# Altium schematic sheet switch_control.SchDoc
size 297 x 209 mm
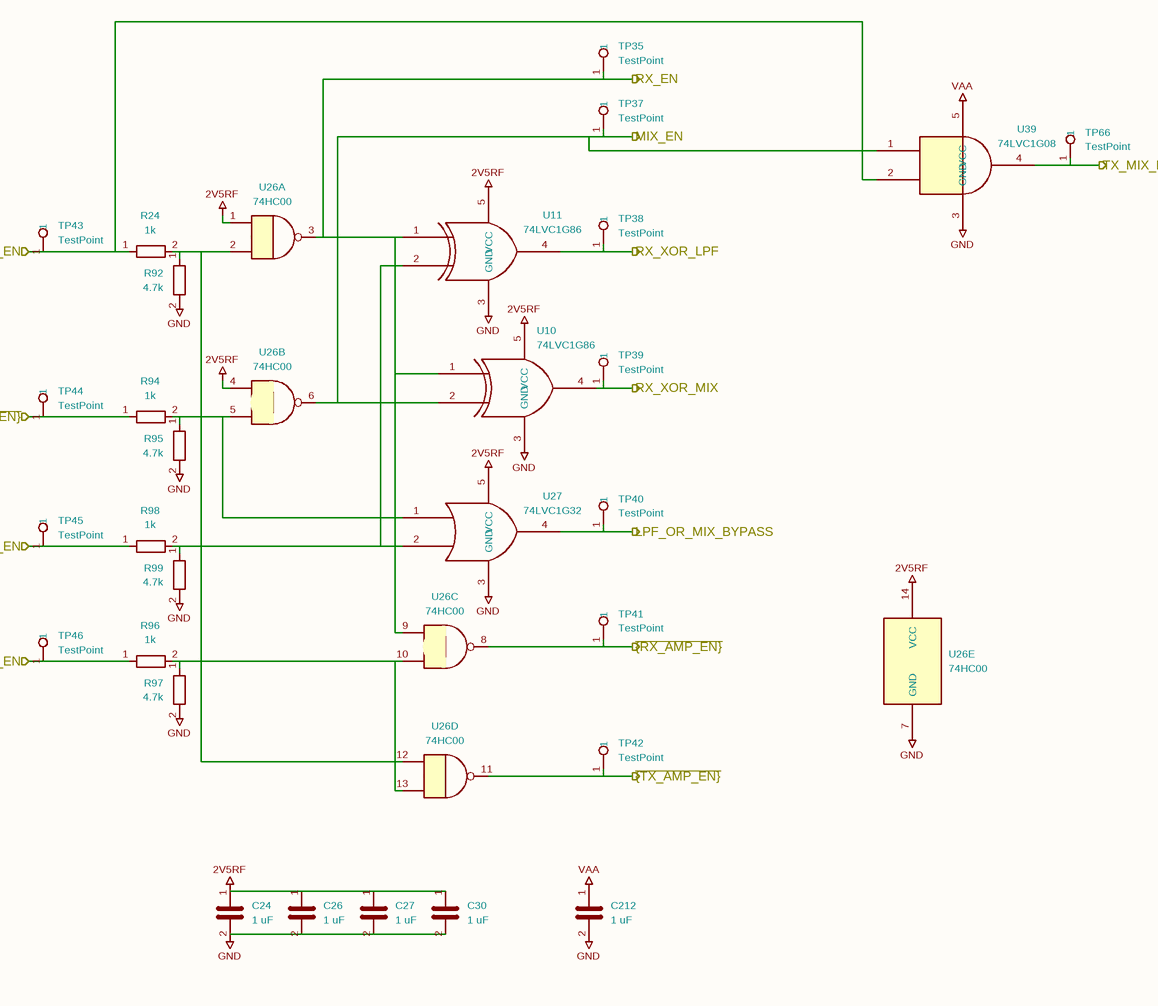
[diagram p0: switch_control.SchDoc]

## Parts
C24  1 uF  [C_0201_0603Metric]
C26  1 uF  [C_0201_0603Metric]
C27  1 uF  [C_0201_0603Metric]
C30  1 uF  [C_0201_0603Metric]
C212  1 uF  [C_0201_0603Metric]
R24  1k  [R_0201_0603Metric]
R92  4.7k  [R_0201_0603Metric]
R94  1k  [R_0201_0603Metric]
R95  4.7k  [R_0201_0603Metric]
R96  1k  [R_0201_0603Metric]
R97  4.7k  [R_0201_0603Metric]
R98  1k  [R_0201_0603Metric]
R99  4.7k  [R_0201_0603Metric]
TP35  TestPoint  [TestPoint_Pad_D1.0mm]
TP37  TestPoint  [TestPoint_Pad_D1.0mm]
TP38  TestPoint  [TestPoint_Pad_D1.0mm]
TP39  TestPoint  [TestPoint_Pad_D1.0mm]
TP40  TestPoint  [TestPoint_Pad_D1.0mm]
TP41  TestPoint  [TestPoint_Pad_D1.0mm]
TP42  TestPoint  [TestPoint_Pad_D1.0mm]
TP43  TestPoint  [TestPoint_Pad_D1.0mm]
TP44  TestPoint  [TestPoint_Pad_D1.0mm]
TP45  TestPoint  [TestPoint_Pad_D1.0mm]
TP46  TestPoint  [TestPoint_Pad_D1.0mm]
TP66  TestPoint  [TestPoint_Pad_D1.0mm]
U10  74LVC1G86  [SOT-353_SC-70-5]
U11  74LVC1G86  [SOT-353_SC-70-5]
U26  74HC00  [DHVQFN-14-1EP_2.5x3mm_P0.5mm_EP1x1.5mm]  (parts A,B,C,D,E of 5)
U27  74LVC1G32  [SOT-353_SC-70-5]
U39  74LVC1G08  [SOT-353_SC-70-5]

## Ports
LPF_EN (in), LPF_OR_MIX_BYPASS (out), MIX_EN (out), RF_AMP_EN (in), RX_EN (out), RX_XOR_LPF (out), RX_XOR_MIX (out), TX_EN (in), TX_MIX_EN (out), ~{{MIX_EN}} (in), ~{{RX_AMP_EN}} (out), ~{{TX_AMP_EN}} (out)

## Nets
2V5RF: C24.1 C26.1 C27.1 C30.1 U10.5(VCC) U11.5(VCC) U26.1 U26.4 U26.14(VCC) U27.5(VCC)
GND: C24.2 C26.2 C27.2 C30.2 C212.2 R92.2 R95.2 R97.2 R99.2 U10.3(GND) U11.3(GND) U26.7(GND) U27.3(GND) U39.3(GND)
VAA: C212.1 U39.5(VCC)
LPF_EN: R98.1 TP45.1 ; port LPF_EN
LPF_OR_MIX_BYPASS: TP40.1 U27.4 ; port LPF_OR_MIX_BYPASS
MIX_EN: TP37.1 U10.2 U26.6 U39.1 ; port MIX_EN
RF_AMP_EN: R96.1 TP46.1 ; port RF_AMP_EN
RX_EN: TP35.1 U10.1 U11.1 U26.3 U26.9 ; port RX_EN
RX_XOR_LPF: TP38.1 U11.4 ; port RX_XOR_LPF
RX_XOR_MIX: TP39.1 U10.4 ; port RX_XOR_MIX
TX_EN: R24.1 TP43.1 U39.2 ; port TX_EN
TX_MIX_EN: TP66.1 U39.4 ; port TX_MIX_EN
~{{MIX_EN}}: R94.1 TP44.1 ; port ~{{MIX_EN}}
~{{RX_AMP_EN}}: TP41.1 U26.8 ; port ~{{RX_AMP_EN}}
~{{TX_AMP_EN}}: TP42.1 U26.11 ; port ~{{TX_AMP_EN}}
NetR24_2: R24.2 R92.1 U26.2 U26.12
NetR94_2: R94.2 R95.1 U26.5 U27.1
NetR96_2: R96.2 R97.1 U26.10 U26.13
NetR98_2: R98.2 R99.1 U11.2 U27.2

## Notes on the sheet
- 1
- 2
- 3
- 4
- 5
- 6
- A
- B
- C
- ${LICENSE}
- D
- Title: ${TITLE}
- File: switch_control.kicad_sch
- Sheet: /
- ${COPYRIGHT}
- KiCad E.D.A.  kicad (5.1.4)-1
- Size: A4
- Date: ${DATE}
- Rev: ${VERSION}
- Id: 1/1

## Library data of the parts
C24 C26 C27 C30 C212 = C: Manufacturer: Murata; Part Number: GRM033R61A105ME44D; Description: CAP CER 1UF 10V X5R 0201; Substitution: GRM033R61A105ME44*, GRM033R61C105ME15*, Samsung CL03A105MO3NRN*; Value: 1 uF; Footprint: Capacitor_SMD:C_0201_0603Metric
R24 R94 R96 R98 = R: Manufacturer: Yageo; Part Number: RC0201FR-071KL; Description: RES 1K OHM 1% 1/20W 0201; Substitution: any equivalent; Value: 1k; Footprint: Resistor_SMD:R_0201_0603Metric
R92 R95 R97 R99 = R: Manufacturer: Yageo; Part Number: RC0201FR-074K7L; Description: RES 4.7K OHM 1% 1/20W 0201; Substitution: any equivalent; Value: 4.7k; Footprint: Resistor_SMD:R_0201_0603Metric
U10 U11 = 74LVC1G86: Manufacturer: UMW; Part Number: SN74LVC1G86DCKR; Description: IC GATE XOR 1CH 2-INP SC70-5; Substitution: TI SN74LVC1G86DCKR; Value: 74LVC1G86; Footprint: Package_TO_SOT_SMD:SOT-353_SC-70-5
U26 = 74HC00: Manufacturer: Nexperia; Part Number: 74HC00BQ,115; Description: IC GATE NAND 4CH 2-INP 14DHVQFN; Value: 74HC00; Footprint: Package_DFN_QFN:DHVQFN-14-1EP_2.5x3mm_P0.5mm_EP1x1.5mm
U27 = 74LVC1G32: Manufacturer: UMW; Part Number: SN74LVC1G32DCKR; Description: IC GATE OR 1CH 2-INP SC70-5; Substitution: TI SN74LVC1G32DCKR; Value: 74LVC1G32; Footprint: Package_TO_SOT_SMD:SOT-353_SC-70-5
U39 = 74LVC1G08: Manufacturer: UMW; Part Number: SN74LVC1G08DCKR; Description: IC GATE AND 1CH 2-INP SC70-5; Substitution: TI SN74LVC1G08DCKR; Value: 74LVC1G08; Footprint: Package_TO_SOT_SMD:SOT-353_SC-70-5
TP35 TP37-TP46 TP66 = TestPoint: Value: TestPoint; Footprint: TestPoint:TestPoint_Pad_D1.0mm